# EAGLE design BareBonesArduino (EAGLE 7.2.0)
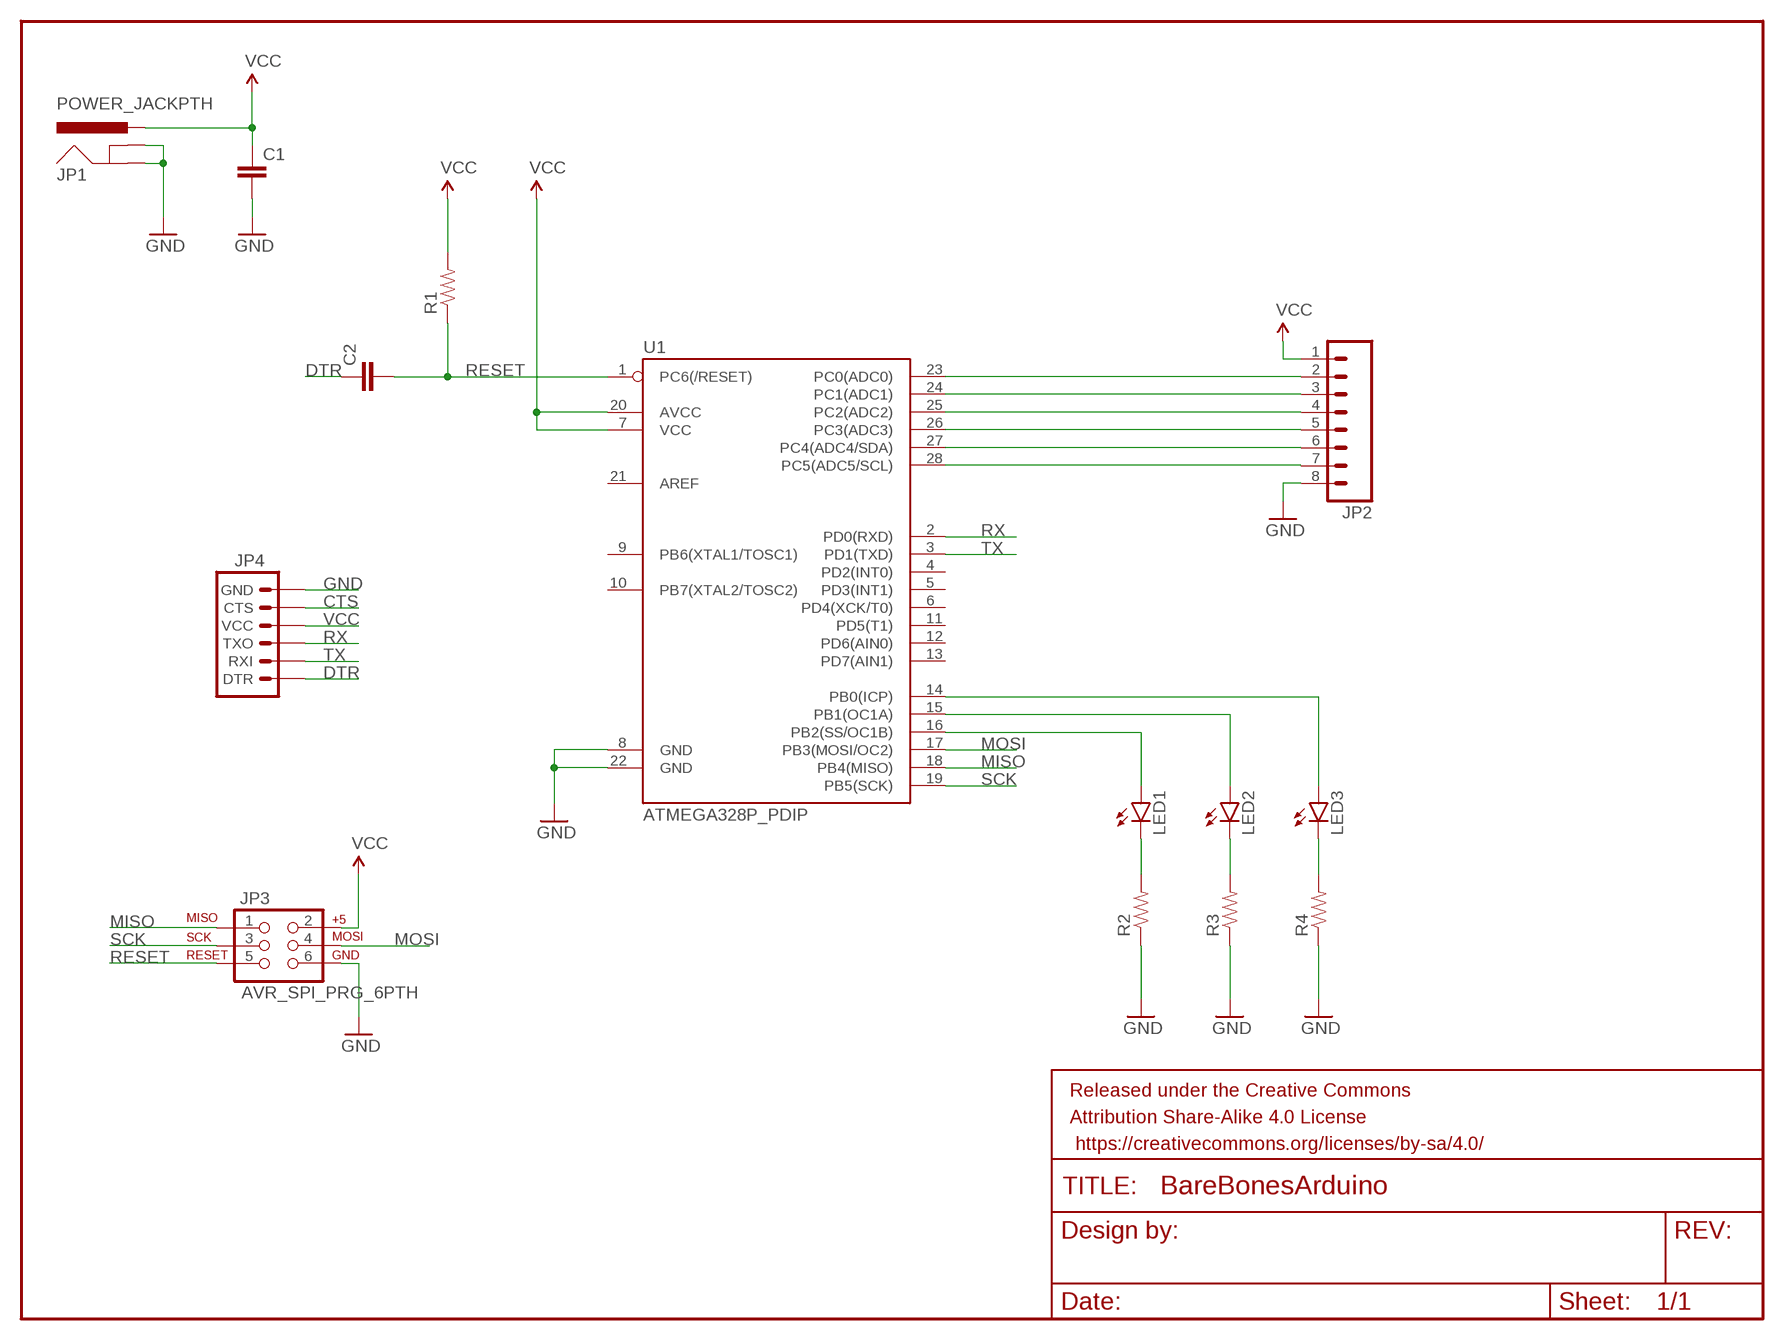
[diagram p0: schematic, sheet 1]

## Parts
C1  CAPPTH  [CAP-PTH-SMALL]
C2  CAPPTH  [CAP-PTH-SMALL]
FRAME1  FRAME-LETTER  [CREATIVE_COMMONS]
JP1  POWER_JACKPTH  [POWER_JACK_PTH]
JP2  M08  [1X08_ROUND]
JP3  AVR_SPI_PRG_6PTH  [2X3]
JP4  ARDUINO_SERIAL_PROGRAMPTH  [1X06]
LED1  LED5MM  [LED5MM]
LED2  LED5MM  [LED5MM]
LED3  LED5MM  [LED5MM]
R1  RESISTORPTH-1/4W  [AXIAL-0.4]
R2  RESISTORPTH-1/4W  [AXIAL-0.4]
R3  RESISTORPTH-1/4W  [AXIAL-0.4]
R4  RESISTORPTH-1/4W  [AXIAL-0.4]
U1  ATMEGA328P_PDIP  [DIL28-3]

## Nets
CTS: JP4.5(CTS)
DTR: C2.1 JP4.1(DTR)
GND: C1.2 JP1.GND JP1.GNDBREAK JP2.8 JP3.6 JP4.6(GND) R2.P$1 R3.P$1 R4.P$1 U1.8(GND) U1.22(GND)
MISO: JP3.1 U1.18(PB4(MISO))
MOSI: JP3.4 U1.17(PB3(MOSI/OC2))
N$2: JP2.2 U1.23(PC0(ADC0))
N$4: JP2.3 U1.24(PC1(ADC1))
N$5: JP2.4 U1.25(PC2(ADC2))
N$6: JP2.5 U1.26(PC3(ADC3))
N$7: JP2.6 U1.27(PC4(ADC4/SDA))
N$8: JP2.7 U1.28(PC5(ADC5/SCL))
N$9: LED1.A U1.16(PB2(SS/OC1B))
N$10: LED2.A U1.15(PB1(OC1A))
N$11: LED3.A U1.14(PB0(ICP))
N$12: LED1.K(C) R2.P$2
N$13: LED2.K(C) R3.P$2
N$14: LED3.K(C) R4.P$2
RESET: C2.2 JP3.5 R1.P$1 U1.1(PC6(/RESET))
RX: JP4.3(TXO) U1.2(PD0(RXD))
SCK: JP3.3 U1.19(PB5(SCK))
TX: JP4.2(RXI) U1.3(PD1(TXD))
VCC: C1.1 JP1.PWR JP2.1 JP3.2 JP4.4(VCC) R1.P$2 U1.7(VCC) U1.20(AVCC)
Unconnected: U1.4(PD2(INT0)) U1.5(PD3(INT1)) U1.6(PD4(XCK/T0)) U1.9(PB6(XTAL1/TOSC1)) U1.10(PB7(XTAL2/TOSC2)) U1.11(PD5(T1)) U1.12(PD6(AIN0)) U1.13(PD7(AIN1)) U1.21(AREF)

## Library data of the parts
C1 C2 = SparkFun-Capacitors:CAP: Capacitor Standard 0603 ceramic capacitor, and 0.1" leaded capacitor.
FRAME1 = SparkFun-Aesthetics:FRAME-LETTER: Schematic Frame Standard 8.5x11 US Letter frame; DESIGNER: NAME; VERSION: v01
JP1 = SparkFun-Connectors:POWER_JACK: Power Jack This is the standard 5.5mm barrel jack for power. The PTH is the most common, proven, reliable, footprint. The Slot footprint only works if the mill layer is transmitted to the PCB fab house so be warned. Mating wall wart : TOL-00298 (and others); PROD_ID: CONN-08197
JP2 = SparkFun-Connectors:M08: Header 8 Standard 8-pin 0.1" header. Use with straight break away headers (SKU : PRT-00116), right angle break away headers (PRT-00553), swiss pins (PRT-00743), machine pins (PRT-00117), and female headers (PRT-00115).
JP3 = SparkFun-Connectors:AVR_SPI_PRG_6: AVR ISP 6 Pin This is the reduced ISP connector for AVR programming. Common on Arduino. This footprint will take up less PCB space and can be used with a 10-pin to 6-pin adapter such as SKU: BOB-08508 **Special note about "TEST_POINT" package. The stop mask is on the top side, so if you want your programming test points to be on the bottom of your board, make sure to place this package on the bottom side of the board. This also ensure that the orientation to program from the bottom side will be correct.
JP4 = SparkFun-Connectors:ARDUINO_SERIAL_PROGRAM: FTDI connector footprints
LED1-LED3 = SparkFun-LED:LED: LEDs Standard schematic elements and footprints for 5mm, 3mm, 1206, and 0603 sized LEDs. 5mm - Spark Fun Electronics SKU : COM-00529 (and others)
R1-R4 = SparkFun-Passives:RESISTOR: Resistor Basic schematic elements and footprints for 0603, 1206, and PTH resistors.
U1 = SparkFun-DigitalIC:ATMEGA328P_PDIP: uC used in the Arduino 32kb flash, 1k EEPROM, 2k SRAM This is the through-hole version of this chip.

## Board
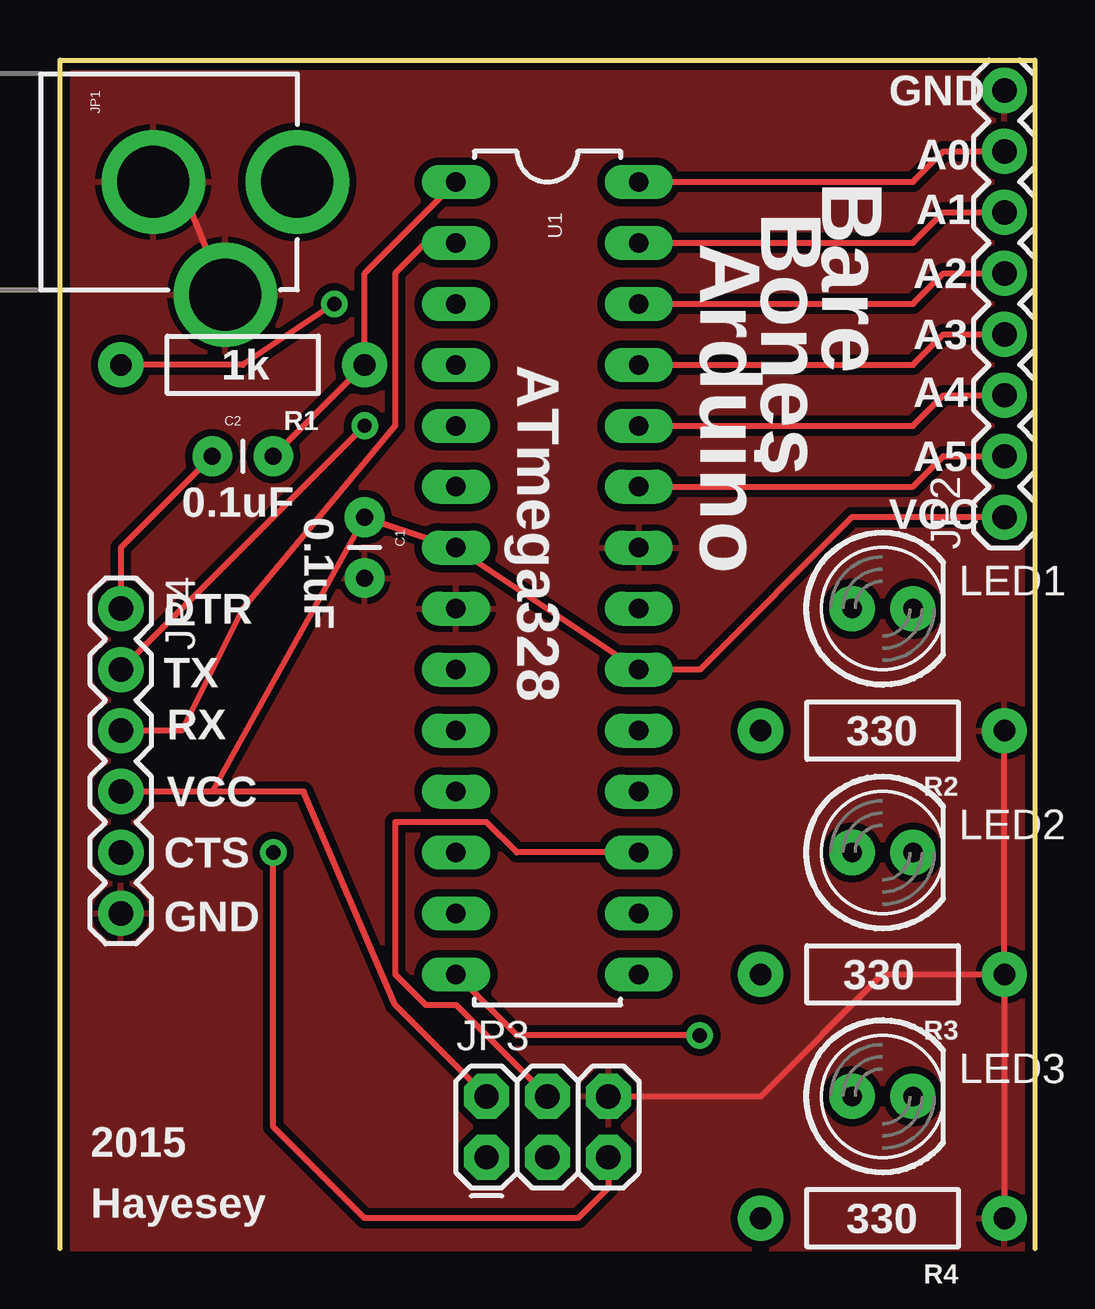
[diagram p1: board, top side]
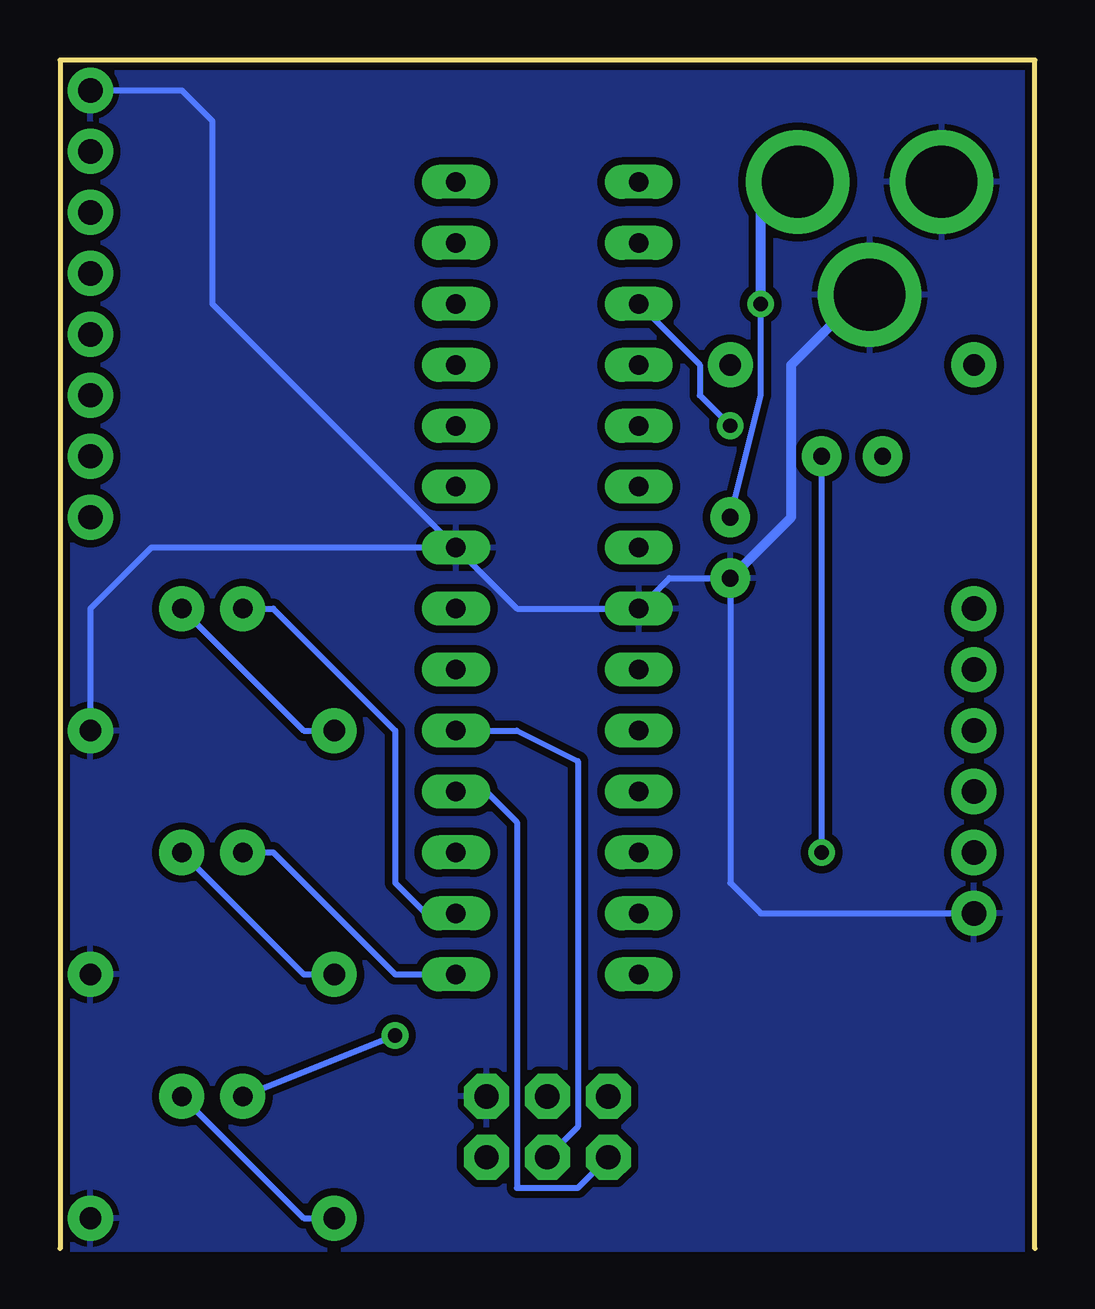
[diagram p2: board, bottom side, seen from below]

Size 40.64 x 49.53 mm. Coordinates in mm from the lower left corner, seen from the top.
Outline: 40.64,0 40.64,49.53 0,49.53 0,0
Copper layers (1*16): Top 0.035mm / dielectric 1.5mm / Bottom 0.035mm
Design rules "SparkFun": minimum track width 8mil, minimum drill 20mil, track to track 8mil, track to pad 8mil, pad to pad 8mil, via to via 8mil, smd to smd 8mil, copper to edge 8mil, drill to drill 8mil, minimum pad ring 12mil, minimum via ring 10mil, stop-mask expansion 4mil, vias tented up to drill 20mil, thermal gap 10mil

### Footprints (pad centres in the part's own frame; a part is rotated, then mirrored left to right if it is on the bottom)
CAP-PTH-SMALL = drill 0.7 pad 1.651: 1 0,0; 2 2.54,0
POWER_JACK_PTH = drill 2.997 pad 4.318: GND 0,7.7; GNDBREAK 4.7,10.7; PWR 0,13.7
1X08_ROUND = drill 1.016 pad 1.88: 1 0,0; 2 2.54,0; 3 5.08,0; 4 7.62,0; 5 10.16,0; 6 12.7,0; 7 15.24,0; 8 17.78,0
2X3 = drill 1.016 pad 1.88 octagon: 1 0,0; 2 0,2.54; 3 2.54,0; 4 2.54,2.54; 5 5.08,0; 6 5.08,2.54
1X06 = drill 1.016 pad 1.88: 1 0,0; 2 2.54,0; 3 5.08,0; 4 7.62,0; 5 10.16,0; 6 12.7,0
LED5MM = drill 0.813 pad 1.88: A -1.27,0; K 1.27,0
AXIAL-0.4 = drill 0.9 pad 1.88: P$1 -5.08,0; P$2 5.08,0
DIL28-3 = drill 0.813 long: 1 -16.51,-3.81; 2 -13.97,-3.81; 3 -11.43,-3.81; 4 -8.89,-3.81; 5 -6.35,-3.81; 6 -3.81,-3.81; 7 -1.27,-3.81; 8 1.27,-3.81; 9 3.81,-3.81; 10 6.35,-3.81; 11 8.89,-3.81; 12 11.43,-3.81; 13 13.97,-3.81; 14 16.51,-3.81; 15 16.51,3.81; 16 13.97,3.81; 17 11.43,3.81; 18 8.89,3.81; 19 6.35,3.81; 20 3.81,3.81; 21 1.27,3.81; 22 -1.27,3.81; 23 -3.81,3.81; 24 -6.35,3.81; 25 -8.89,3.81; 26 -11.43,3.81; 27 -13.97,3.81; 28 -16.51,3.81

### Placement (x,y rotation side)
C1  12.7,30.48 270 top
C2  6.35,33.02 0 top
FRAME1  -101.6,29.21 0 top  (outside the outline)
JP1  -3.81,44.45 270 top
JP2  39.37,30.48 90 top
JP3  17.78,3.81 0 top
JP4  2.54,26.67 270 top
LED1  34.29,26.67 0 top
LED2  34.29,16.51 0 top
LED3  34.29,6.35 0 top
R1  7.62,36.83 180 top
R2  34.29,21.59 180 top
R3  34.29,11.43 180 top
R4  34.29,1.27 180 top
U1  20.32,27.94 270 top

### Tracks (layer width: path | path; a pad name or v marks a point on that pad's centre or on a via)
DTR
  Top 0.254: C2.1 2.54,29.21 JP4.1
GND
  Top 0.254: JP3.6 29.21,6.35 34.29,11.43 R3.P$1 | R3.P$1 R2.P$1 | R3.P$1 R4.P$1 | JP1.GNDBREAK 5.16,44.02 JP1.GND
  Bottom 0.254: JP2.8 35.56,48.26 34.29,46.99 34.29,39.37 U1.22 | U1.22 21.59,26.67 U1.8 15.24,27.94 C1.2 12.7,15.24 11.43,13.97 JP4.6 | U1.22 36.83,29.21 39.37,26.67 R2.P$1
  Bottom 0.406: C1.2 10.16,30.48 10.16,36.83 7.24,39.75 JP1.GNDBREAK
  pour Top (isolate 0.305): 0,49.53 40.64,49.53 40.64,0 0,0
  pour Bottom (isolate 0.305): 0,49.53 40.64,49.53 40.64,0 0,0
MISO
  Bottom 0.254: U1.18 22.86,19.05 21.59,17.78 21.59,2.54 19.05,2.54 JP3.1
MOSI
  Top 0.254: U1.17 19.05,16.51 17.78,17.78 13.97,17.78 13.97,11.43 15.24,10.16 16.51,10.16 JP3.4
N$2
  Top 0.254: U1.23 35.56,31.75 36.83,33.02 JP2.2
N$4
  Top 0.254: U1.24 35.56,34.29 36.83,35.56 JP2.3
N$5
  Top 0.254: U1.25 35.56,36.83 36.83,38.1 JP2.4
N$6
  Top 0.254: U1.26 35.56,39.37 36.83,40.64 JP2.5
N$7
  Top 0.254: U1.27 35.56,41.91 36.83,43.18 JP2.6
N$8
  Top 0.254: U1.28 35.56,44.45 36.83,45.72 JP2.7
N$9
  Bottom 0.254: LED1.A 31.75,26.67 26.67,21.59 26.67,15.24 25.4,13.97 U1.16
N$10
  Bottom 0.254: LED2.A 31.75,16.51 26.67,11.43 U1.15
N$11  (via drill 0.6)
  Top 0.254: v26.67,8.89 19.05,8.89 U1.14
  Bottom 0.254: LED3.A v26.67,8.89
N$12
  Bottom 0.254: LED1.K 30.48,21.59 R2.P$2
N$13
  Bottom 0.254: LED2.K 30.48,11.43 R3.P$2
N$14
  Bottom 0.254: LED3.K 30.48,1.27 R4.P$2
RESET  (via drill 0.6)
  Top 0.254: U1.1 12.7,40.64 R1.P$1 C2.2 | JP3.5 22.86,2.54 21.59,1.27 12.7,1.27 8.89,5.08 v8.89,16.51
  Bottom 0.254: v8.89,16.51 C2.2
RX
  Top 0.254: U1.2 15.24,41.91 13.97,40.64 13.97,34.29 7.62,26.67 5.08,21.59 JP4.3
SCK
  Bottom 0.254: U1.19 21.59,21.59 19.05,20.32 19.05,5.08 JP3.3
TX  (via drill 0.6)
  Top 0.254: JP4.2 v12.7,34.29
  Bottom 0.254: U1.3 13.97,36.83 13.97,35.56 v12.7,34.29
VCC  (via drill 0.6)
  Top 0.254: JP2.1 33.02,30.48 26.67,24.13 U1.20 U1.7 C1.1 6.35,19.05 | 6.35,19.05 JP4.4 | JP3.2 13.97,10.16 10.16,19.05 6.35,19.05 | v11.43,39.37 7.62,36.83 R1.P$2
  Bottom 0.254: C1.1 11.43,35.56 v11.43,39.37
  Bottom 0.406: v11.43,39.37 11.43,43.18 11.16,43.18 JP1.PWR

### Text on the board
tPlace: GND | A0 | Bare | Bare | Bones | A1 | Arduino | A2 | ATmega328 | A3 | 1k | A4 | A5 | 0.1uF | 0.1uF | VCC | DTR | TX | RX | 330 | VCC | CTS | GND | 330 | 2015 | Hayesey | 330